# Altium project E17-08-HIU.PrjPcb
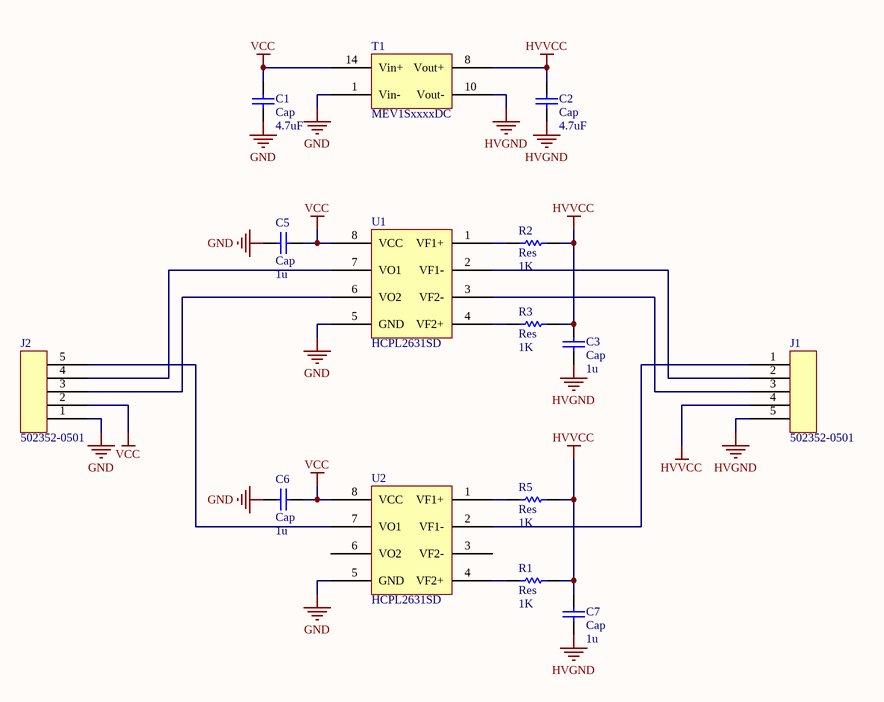
[diagram p0: E17-08-HIU.SchDoc]
1 sheet, 15 parts. Net scope: global (net labels, ports and power ports of the same name join across sheets).
Board file: E17-08-HIU.PcbDoc

## Sheet E17-08-HIU.SchDoc
size A4

### Parts
C1  Cap  value 4.7uF  [C1206]
C2  Cap  value 4.7uF  [C1206]
C3  Cap  value 1u  [C0805]
C5  Cap  value 1u  [C0805]
C6  Cap  value 1u  [C0805]
C7  Cap  value 1u  [C0805]
J1  502352-0501  [502352-0501]
J2  502352-0501  [502352-0501]
R1  Res  value 1K  [2012[0805]]
R2  Res  value 1K  [2012[0805]]
R3  Res  value 1K  [2012[0805]]
R5  Res  value 1K  [2012[0805]]
T1  MEV1SxxxxDC  [MEV1SxxxxDC]
U1  HCPL2631SD  [HCPL2631SD]
U2  HCPL2631SD  [HCPL2631SD]

### Nets
GND: C1.1 C5.1 C6.1 J2.1 T1.1(Vin-) U1.5(GND) U2.5(GND)
HVGND: C2.1 C3.1 C7.1 J1.5 T1.10(Vout-)
HVVCC: C2.2 C3.2 C7.2 J1.4 R1.2 R2.2 R3.2 R5.2 T1.8(Vout+)
VCC: C1.2 C5.2 C6.2 J2.2 T1.14(Vin+) U1.8(VCC) U2.8(VCC)
NetJ1_1: J1.1 U2.2(VF1-)
NetJ1_2: J1.2 U1.2(VF1-)
NetJ1_3: J1.3 U1.3(VF2-)
NetJ2_3: J2.3 U1.6(VO2)
NetJ2_4: J2.4 U1.7(VO1)
NetJ2_5: J2.5 U2.7(VO1)
NetR1_1: R1.1 U2.4(VF2+)
NetR2_1: R2.1 U1.1(VF1+)
NetR3_1: R3.1 U1.4(VF2+)
NetR5_1: R5.1 U2.1(VF1+)

Not connected (* = marked no-connect by the designer): U2 3(VF2-) 6(VO2)

### Library data of the parts
C1-C3 C5-C7 = Cap: Capacitor; Published: 8-Jun-2000; LatestRevisionDate: 17-Jul-2002; LatestRevisionNote: Re-released for DXP Platform.; PackageReference: C1206; Publisher: Altium Limited
R1-R3 R5 = Res: Surface Mount Resistor; Published: 8-Jun-2000; LatestRevisionDate: 17-Jul-2002; LatestRevisionNote: Re-released for DXP Platform.; PackageReference: AXIAL-0.5; Publisher: Altium Limited